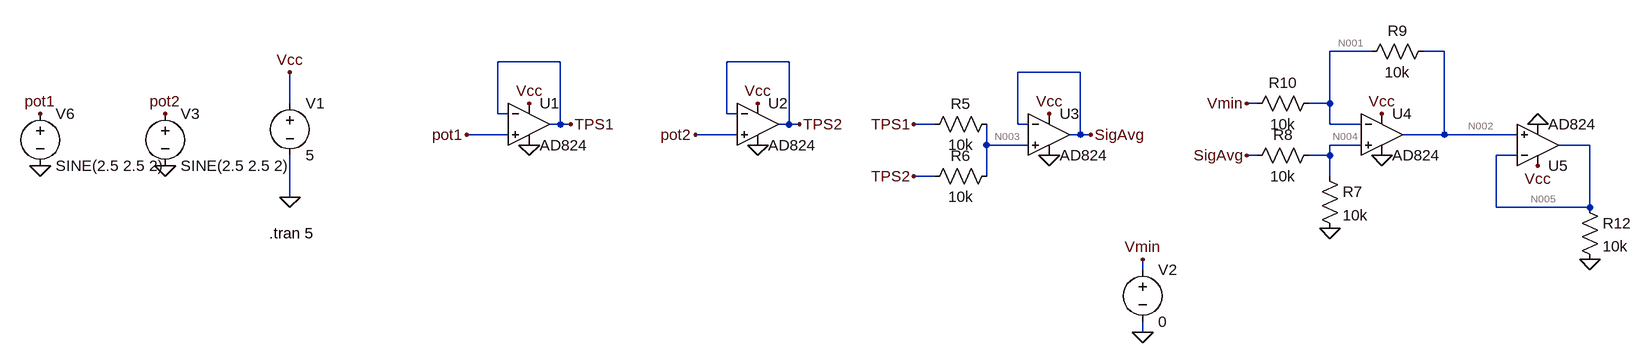
[diagram p0: schematic Rudimentary APPS.asc]
Rudimentary APPS.asc, the LTspice schematic file:
Version 4
SHEET 1 1812 680
WIRE 1408 32 1344 32
WIRE 1520 32 1488 32
WIRE 160 48 64 48
WIRE 512 48 416 48
WIRE 960 64 864 64
WIRE -256 112 -256 64
WIRE 1232 112 1216 112
WIRE 1344 112 1344 32
WIRE 1344 112 1312 112
WIRE 64 128 64 48
WIRE 80 128 64 128
WIRE 416 128 416 48
WIRE 432 128 416 128
WIRE 160 144 160 48
WIRE 160 144 144 144
WIRE 176 144 160 144
WIRE 512 144 512 48
WIRE 512 144 496 144
WIRE 528 144 512 144
WIRE 736 144 704 144
WIRE 864 144 864 64
WIRE 880 144 864 144
WIRE 1344 144 1344 112
WIRE 1392 144 1344 144
WIRE 80 160 16 160
WIRE 432 160 368 160
WIRE 960 160 960 64
WIRE 960 160 944 160
WIRE 976 160 960 160
WIRE 1520 160 1520 32
WIRE 1520 160 1456 160
WIRE 1632 160 1520 160
WIRE 816 176 816 144
WIRE 880 176 816 176
WIRE 1392 176 1344 176
WIRE 1744 176 1696 176
WIRE 1232 192 1216 192
WIRE 1344 192 1344 176
WIRE 1344 192 1312 192
WIRE 1632 192 1600 192
WIRE 736 224 704 224
WIRE 816 224 816 176
WIRE 1344 224 1344 192
WIRE -256 256 -256 192
WIRE 1600 272 1600 192
WIRE 1744 272 1744 176
WIRE 1744 272 1600 272
WIRE 1056 368 1056 352
WIRE 1056 464 1056 448
FLAG 176 144 TPS1
FLAG 528 144 TPS2
FLAG 464 112 Vcc
FLAG 112 112 Vcc
FLAG 464 176 0
FLAG 112 176 0
FLAG 912 128 Vcc
FLAG 912 192 0
FLAG 976 160 SigAvg
FLAG 704 144 TPS1
FLAG 704 224 TPS2
FLAG -256 64 Vcc
FLAG -256 256 0
FLAG 1424 128 Vcc
FLAG 1424 192 0
FLAG 1216 112 Vmin
FLAG 1216 192 SigAvg
FLAG 1344 304 0
FLAG 1056 352 Vmin
FLAG 1056 464 0
FLAG 1664 208 Vcc
FLAG 1664 144 0
FLAG 1744 352 0
FLAG -640 128 pot1
FLAG 16 160 pot1
FLAG -448 128 pot2
FLAG 368 160 pot2
FLAG -640 208 0
FLAG -448 208 0
SYMBOL Opamps\\AD824 112 80 R0
SYMATTR InstName U1
SYMBOL Opamps\\AD824 464 80 R0
SYMATTR InstName U2
SYMBOL Opamps\\AD824 912 96 R0
SYMATTR InstName U3
SYMBOL res 832 128 R90
WINDOW 0 0 56 VBottom 2
WINDOW 3 32 56 VTop 2
SYMATTR InstName R5
SYMATTR Value 10k
SYMBOL res 832 208 R90
WINDOW 0 0 56 VBottom 2
WINDOW 3 32 56 VTop 2
SYMATTR InstName R6
SYMATTR Value 10k
SYMBOL voltage -256 96 R0
WINDOW 123 0 0 Left 0
WINDOW 39 0 0 Left 0
SYMATTR InstName V1
SYMATTR Value 5
SYMBOL Opamps\\AD824 1424 96 R0
SYMATTR InstName U4
SYMBOL res 1328 208 R0
SYMATTR InstName R7
SYMATTR Value 10k
SYMBOL res 1328 176 R90
WINDOW 0 0 56 VBottom 2
WINDOW 3 32 56 VTop 2
SYMATTR InstName R8
SYMATTR Value 10k
SYMBOL res 1504 16 R90
WINDOW 0 0 56 VBottom 2
WINDOW 3 32 56 VTop 2
SYMATTR InstName R9
SYMATTR Value 10k
SYMBOL res 1328 96 R90
WINDOW 0 0 56 VBottom 2
WINDOW 3 32 56 VTop 2
SYMATTR InstName R10
SYMATTR Value 10k
SYMBOL voltage 1056 352 R0
WINDOW 123 0 0 Left 0
WINDOW 39 0 0 Left 0
SYMATTR InstName V2
SYMATTR Value 0
SYMBOL Opamps\\AD824 1664 240 M180
SYMATTR InstName U5
SYMBOL res 1728 256 R0
SYMATTR InstName R12
SYMATTR Value 10k
SYMBOL voltage -448 112 R0
WINDOW 123 0 0 Left 0
WINDOW 39 0 0 Left 0
SYMATTR InstName V3
SYMATTR Value SINE(2.5 2.5 2)
SYMBOL voltage -640 112 R0
WINDOW 123 0 0 Left 0
WINDOW 39 0 0 Left 0
SYMATTR InstName V6
SYMATTR Value SINE(2.5 2.5 2)
TEXT -288 312 Left 2 !.tran 5

The netlist it stands for:
* Rudimentary APPS.asc
XU1 pot1 TPS1 Vcc 0 TPS1 AD824  ; pins In+ In- V+ V- OUT
XU2 pot2 TPS2 Vcc 0 TPS2 AD824  ; pins In+ In- V+ V- OUT
XU3 N003 SigAvg Vcc 0 SigAvg AD824  ; pins In+ In- V+ V- OUT
R5 N003 TPS1 10k
R6 N003 TPS2 10k
V1 Vcc 0 5
XU4 N004 N001 Vcc 0 N002 AD824  ; pins In+ In- V+ V- OUT
R7 N004 0 10k
R8 N004 SigAvg 10k
R9 N002 N001 10k
R10 N001 Vmin 10k
V2 Vmin 0 0
XU5 N002 N005 Vcc 0 N005 AD824  ; pins In+ In- V+ V- OUT
R12 N005 0 10k
V3 pot2 0 SINE(2.5 2.5 2)
V6 pot1 0 SINE(2.5 2.5 2)
.tran 5
.backanno
.end

* Results of the author's LTspice run, read from the files saved beside the schematic
* Operating Point, zero values left out:
*   V(vcc) = 5 V
*   V(pot1) = 2.5 V
*   V(tps1) = 2.5 V
*   V(pot2) = 2.5 V
*   V(tps2) = 2.5 V
*   V(n003) = 2.5 V
*   V(sigavg) = 2.5 V
*   V(n004) = 1.25 V
*   V(n001) = 1.25 V
*   V(n002) = 2.5 V
*   V(n005) = 2.5 V
*   I(R12) = 250 µA
*   I(R10) = 125 µA
*   I(R9) = 125 µA
*   I(R8) = -125 µA
*   I(R7) = 125 µA
*   I(R6) = 3.653 pA
*   I(R5) = 3.653 pA
*   I(V6) = 7.307 pA
*   I(V3) = 7.307 pA
*   I(V2) = 125 µA
*   I(V1) = -2.811 mA